# EAGLE design smr5 (EAGLE 7.2.0)
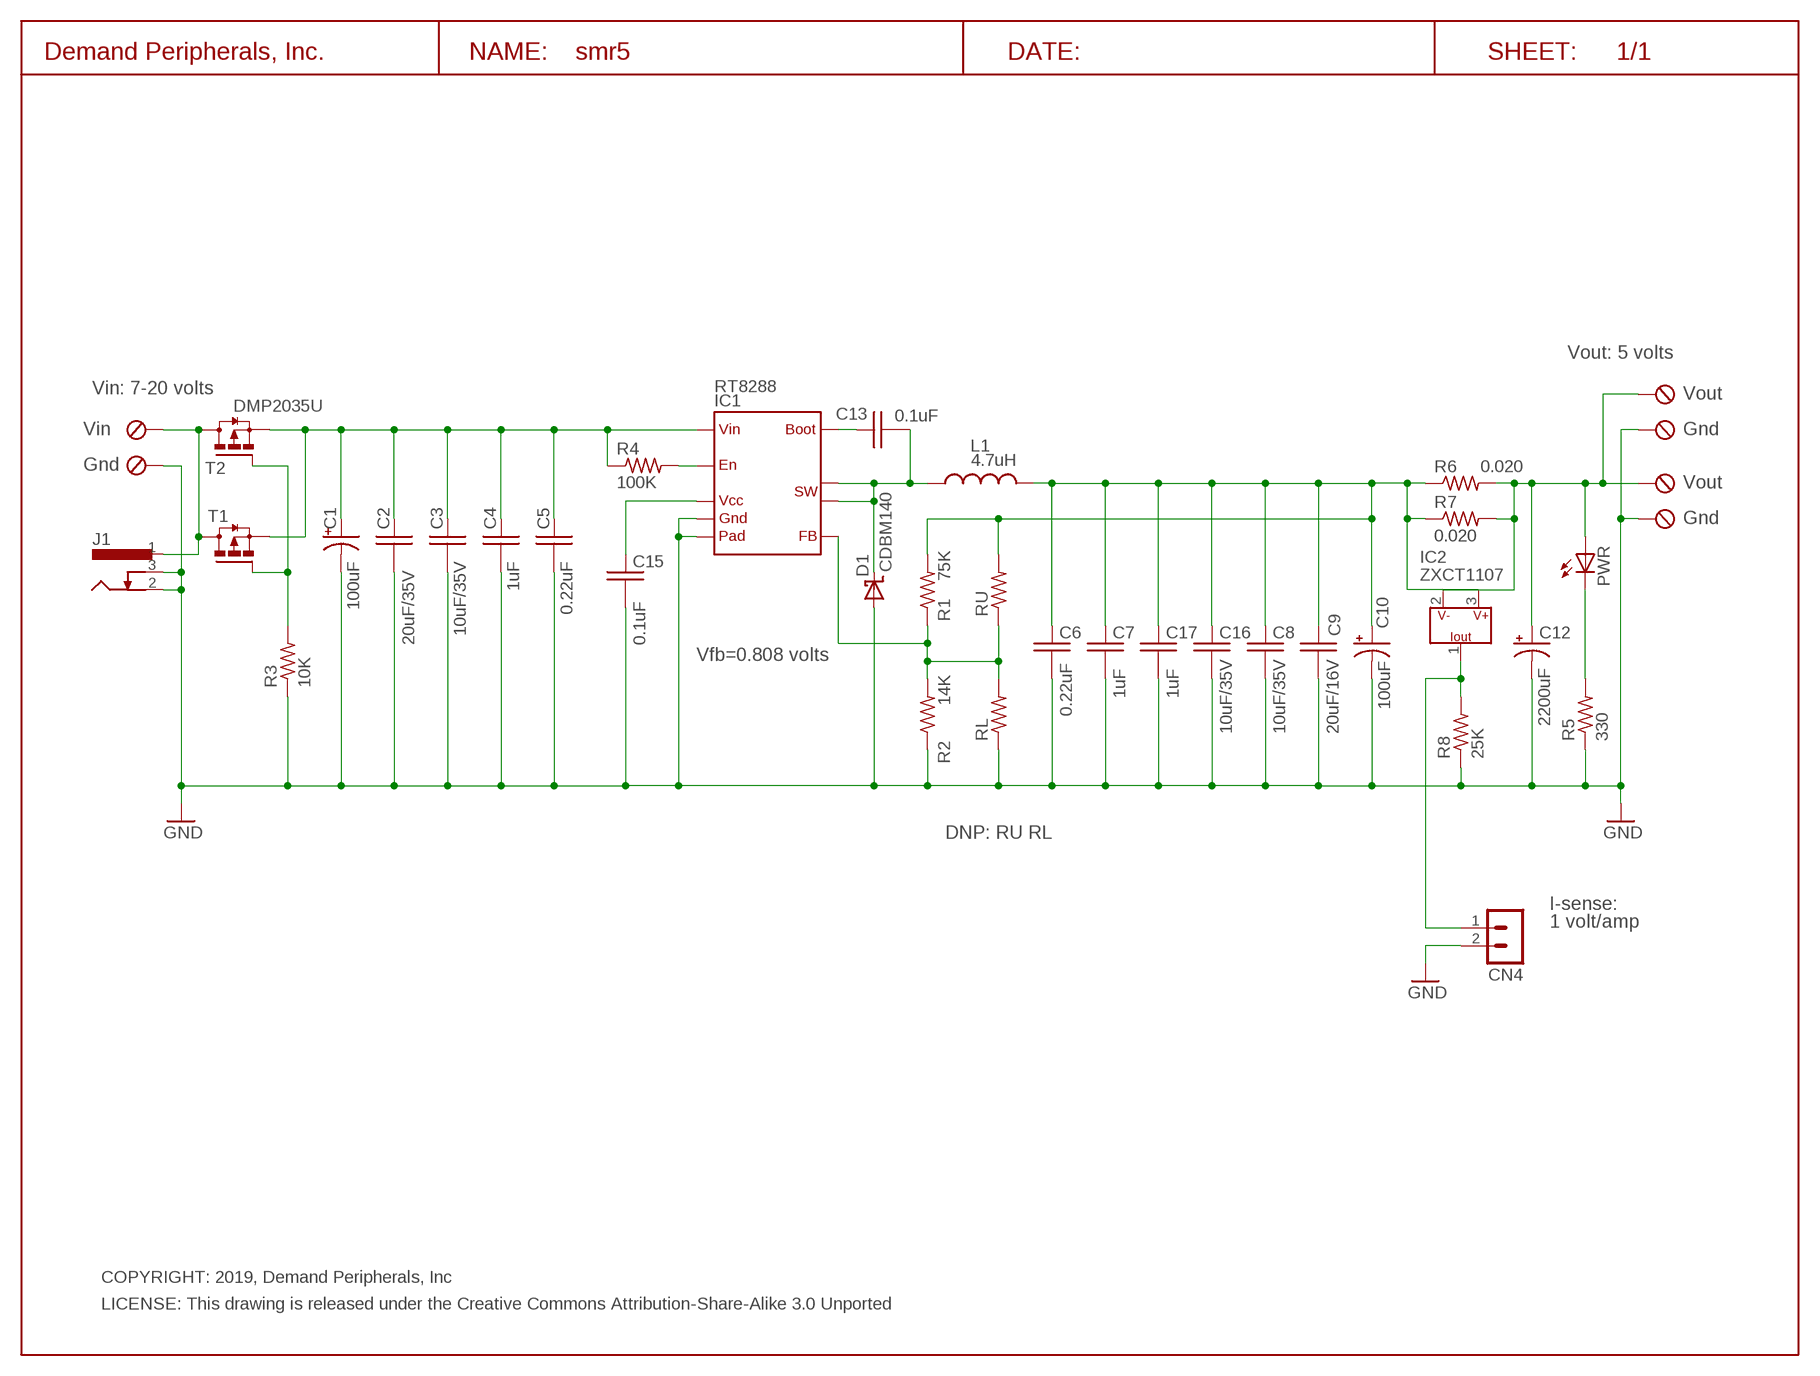
[diagram p0: schematic, sheet 1]

## Parts
C1  100uF  C100UF_E3.5-8  [E3.5-8]
C2  20uF/35V  C22UF35V_  [C1206]
C3  10uF/35V  C10UF35V_C0805  [C0805]
C4  1uF  C1.0UF_C0603  [C0603]
C5  0.22uF  C0.22UFC0805  [C0805]
C6  0.22uF  C0.22UFC0805  [C0805]
C7  1uF  C1.0UF_C0603  [C0603]
C8  10uF/35V  C10UF35V_C0805  [C0805]
C9  20uF/16V  C22UF16V_  [C1210]
C10  100uF  C100UF_E3.5-8  [E3.5-8]
C12  2200uF  C2200UF10V_E7,5-16  [E7,5-16]
C13  0.1uF  C0.1UF_C0603  [C0603]
C15  0.1uF  C0.1UF_C0603  [C0603]
C16  10uF/35V  C10UF35V_C0805  [C0805]
C17  1uF  C1.0UF_C0603  [C0603]
CN1  TBLK-5.08-X2  [TBLK-5.08-X2]
CN2  TBLK-5.08-X2  [TBLK-5.08-X2]
CN3  TBLK-5.08-X2  [TBLK-5.08-X2]
CN4  HDR-2X1-LCK  [HDR-2X1]
D1  CDBM140  [SOD123T]
IC1  RT8288  [SOIC8-PAD]
IC2  ZXCT1107  [ZXCT]
J1  DC-BARREL-JACK--55MM  [DC-BARREL-JACK-55MM]
L1  4.7uH  VLF10045-4.7  [TDKVLFIND]
PWR  LED-5MM-RED  [LED5MM]
R1  75K  R75K_R0603  [R0603]
R2  14K  R14K_R0603  [R0603]
R3  10K  R10K_R0603  [R0603]
R4  100K  R100K_R0603  [R0603]
R5  330  R330_R0603  [R0603]
R6  0.020  R0.02_R0805  [R0805]
R7  0.020  R0.02_R0805  [R0805]
R8  25K  R25K_R0603  [R0603]
RL  R0.02_R0805  [R0805]
RU  R0.02_R0805  [R0805]
T1  DMP2035U  DMP2035  [SOT23]
T2  DMP2035U  DMP2035  [SOT23]
U$1  DP_FRAME_L  [LETTER_L]

## Nets
GND: C1.- C2.2 C3.2 C4.2 C5.2 C6.2 C7.2 C8.2 C9.2 C10.- C12.- C15.2 C16.2 C17.2 CN1.1(KL) CN2.1(KL) CN3.1(KL) CN4.2 D1.A IC1.8(GND) IC1.9(GND-PAD) J1.2 J1.3 R2.1 R3.1 R5.1 R8.1 RL.1
N$1: R3.2 T1.1(G) T2.1(G)
N$2: C13.1 IC1.4(BOOT)
N$3: C13.2 D1.C(CC) IC1.2(SW0) IC1.3(SW1) L1.P$1
N$4: PWR.C R5.2
N$5: CN4.1 IC2.1(IOUT) R8.2
N$6: C12.+ CN2.2(KL1) CN3.2(KL1) IC2.2(V-) PWR.A R6.2 R7.2
N$17: IC1.5(EN) R4.2
N$19: C15.1 IC1.7(VCC)
N$21: IC1.6(FB) R1.1 R2.2 RL.2 RU.1
N$23: CN1.2(KL1) J1.1 T1.3(D) T2.3(D)
SW-OUT: C6.1 C7.1 C8.1 C9.1 C10.+ C16.1 C17.1 IC2.3(V+) L1.P$2 R1.2 R6.1 R7.1 RU.2
V+: C1.+ C2.1 C3.1 C4.1 C5.1 IC1.1(VIN) R4.1 T1.2(S) T2.2(S)

## Notes on the sheet
- Vout: 5 volts
- Vin: 7-20 volts | Vout
- Vin | Gnd
- Gnd
- Vout
- Gnd
- Vfb=0.808 volts
- DNP: RU RL
- I-sense:
- 1 volt/amp
- COPYRIGHT: 2019, Demand Peripherals, Inc
- LICENSE: This drawing is released under the Creative Commons Attribution-Share-Alike 3.0 Unported

## Library data of the parts
C1 C10 = dpi-passive:C100UF_: 100uF polarized capacitor, general purpose; VENDOR: Digikey; VENDOR-PART-NUM: 1572-1044-ND
C2 = dpi-passive:C22UF35V_: 22uF X5R ceramic capacitor, 35V, low ESR; VENDOR: Digikey; VENDOR-PART-NUM: 445-8045-1-ND
C3 C8 C16 = dpi-passive:C10UF35V_: 10 uF Capacitor, 35V, X6S; VENDOR: Digikey; VENDOR-PART-NUM: 490-10504-2-ND
C4 C7 C17 = dpi-passive:C1.0UF_: 1.0 uF Capacitor, 25V, Y5V; VENDOR: Digikey; VENDOR-PART-NUM: 490-3897-2-ND
C5 C6 = dpi-passive:C0.22UF: 0.22 uF Capacitor, 50V, X7R; VENDOR: Digikey; VENDOR-PART-NUM: 1276-6478-1-ND
C9 = dpi-passive:C22UF16V_: 22uF X7R ceramic capacitor, 16V, low ESR; VENDOR: Digikey; VENDOR-PART-NUM: 490-4740-1-ND
C12 = dpi-passive:C2200UF10V_: 2200uF polarized capacitor, 10 volts, general purpose; VENDOR: Digikey; VENDOR-PART-NUM: 493-1503-ND
C13 C15 = dpi-passive:C0.1UF_: 0.1 uF Capacitor, 25V, X7R; VENDOR: Digikey; VENDOR-PART-NUM: 1276-1126-2-ND
CN1-CN3 = dpi-conn:TBLK-5.08-X2: Terminal Block, 5.08mm, x2, screw terminals; VENDOR: Digikey; VENDOR-PART-NUM: ED2609-ND
CN4 = dpi-conn:HDR-2X1-LCK: 2x1 pin header with friction lock; VENDOR: Mouser; VENDOR-PART-NUM: 571-6404562
D1 = dpi-diopto:CDBM140: CDBM140 Schottky, 1A, 200V; VENDOR: Digikey; VENDOR-PART-NUM: 641-1325-1-ND
IC1 = dpi-transic:RT8288: 4 Amp synchronous switching regulator; VENDOR: Digikey; VENDOR-PART-NUM: 1028-1148-1-ND
IC2 = dpi-transic:ZXCT1107: ZXCT 1107 Current monitor
J1 = dpi-conn:DC-BARREL-JACK--55MM: 5.5 mm DC POWER JACK, CUI PJ-102AH; VENDOR: Digikey; VENDOR-PART-NUM: CP-102AH-ND
L1 = dpi-passive:VLF10045-4.7: 4.7 uH VLF10045; VENDOR: Digikey; VENDOR-PART-NUM: 445-3576-1-ND
PWR = dpi-diopto:LED-5MM-RED: Red LED, 5 MM, through-hole; VENDOR: Digikey; VENDOR-PART-NUM: 160-1853-ND
R1 = dpi-passive:R75K_: 75K Resistor, 1%, 0.1 watt; VENDOR: Digikey; VENDOR-PART-NUM: 311-75.0KHRTR-ND
R2 = dpi-passive:R14K_: 14K Resistor, 1%, 0.1 watt; VENDOR: Digikey; VENDOR-PART-NUM: 311-14.0KHRTR-ND
R3 = dpi-passive:R10K_: 10K Resistor, 1%, 0.1 watt; VENDOR: Digikey; VENDOR-PART-NUM: 311-1.00KHRTR-ND
R4 = dpi-passive:R100K_: 100K Resistor, 1%, 0.1 watt; VENDOR: Digikey; VENDOR-PART-NUM: 311-100KHRTR-ND
R5 = dpi-passive:R330_: 330 Ohm resistor, 1%, 0.1 watt; VENDOR: Digikey; VENDOR-PART-NUM: 311-330HRTR-ND
R6 R7 RL RU = dpi-passive:R0.02_: 0.02 Ohm resistor, 1%, 0.33 watt; VENDOR: Digikey; VENDOR-PART-NUM: 1276-6157-1-ND
R8 = dpi-passive:R25K_: 25K Resistor, 1%, 0.1 watt; VENDOR: Digikey; VENDOR-PART-NUM: 311-25.0KHRTR-ND
T1 T2 = dpi-transic:DMP2035: PFET; VENDOR: Digikey; VENDOR-PART-NUM: DMP2035U-7DICT-ND
U$1 = DP:DP_FRAME_L: Landscape/Letter Document Frame

## Board
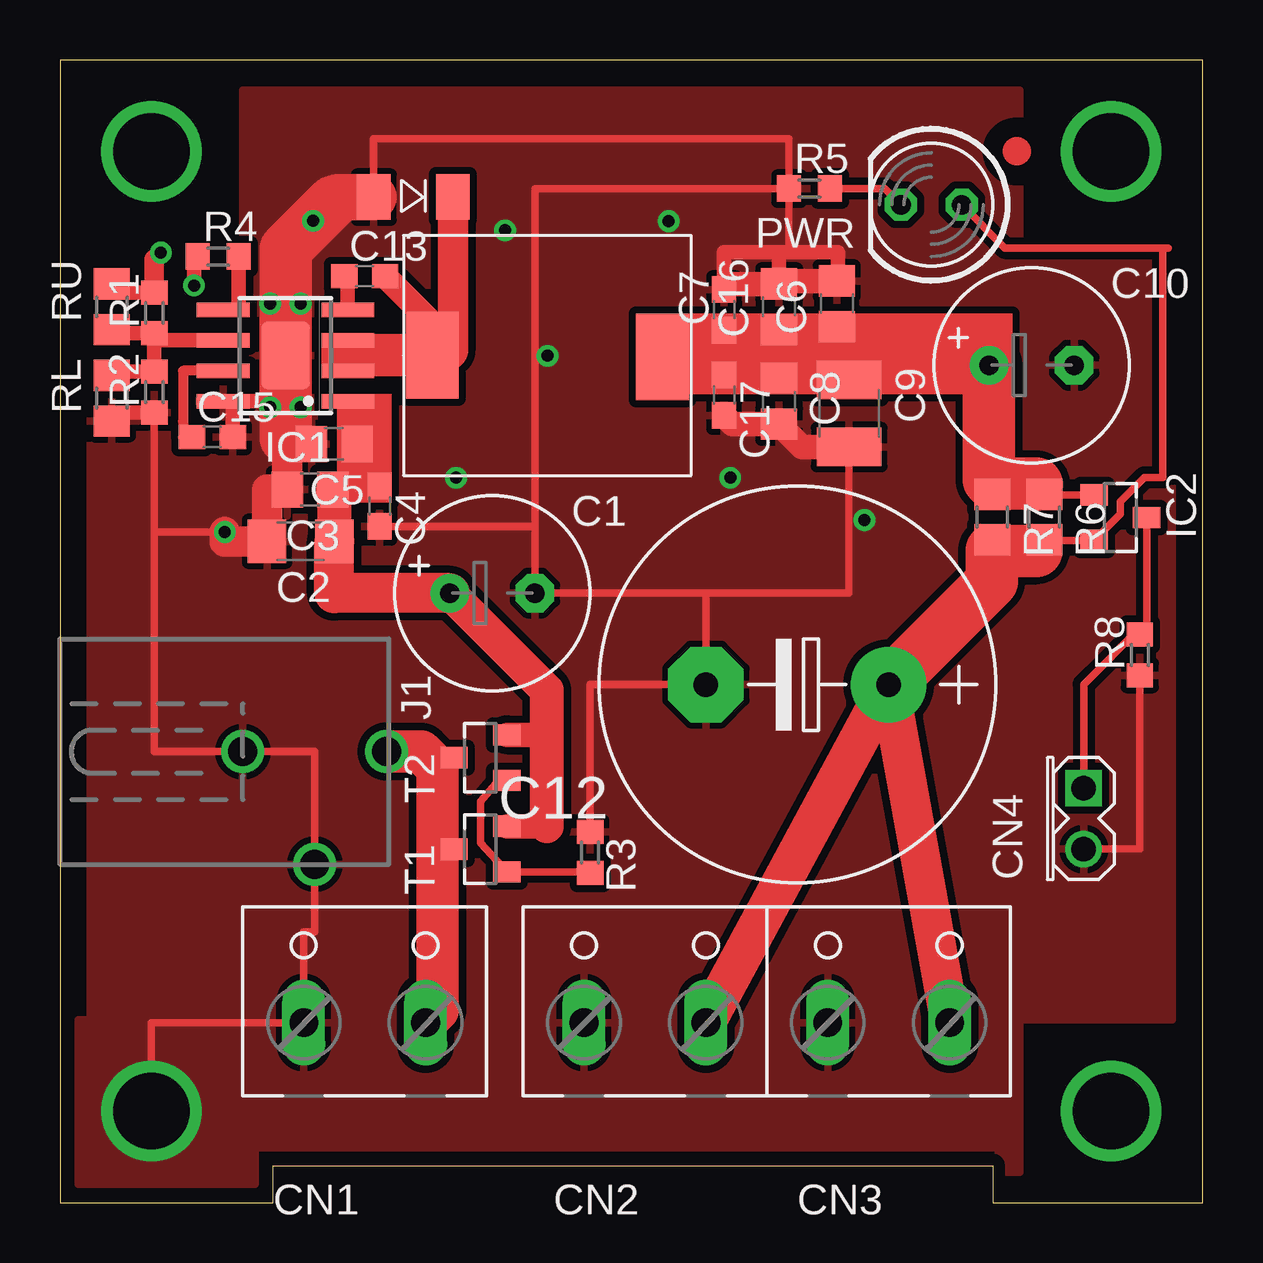
[diagram p1: board, top side]
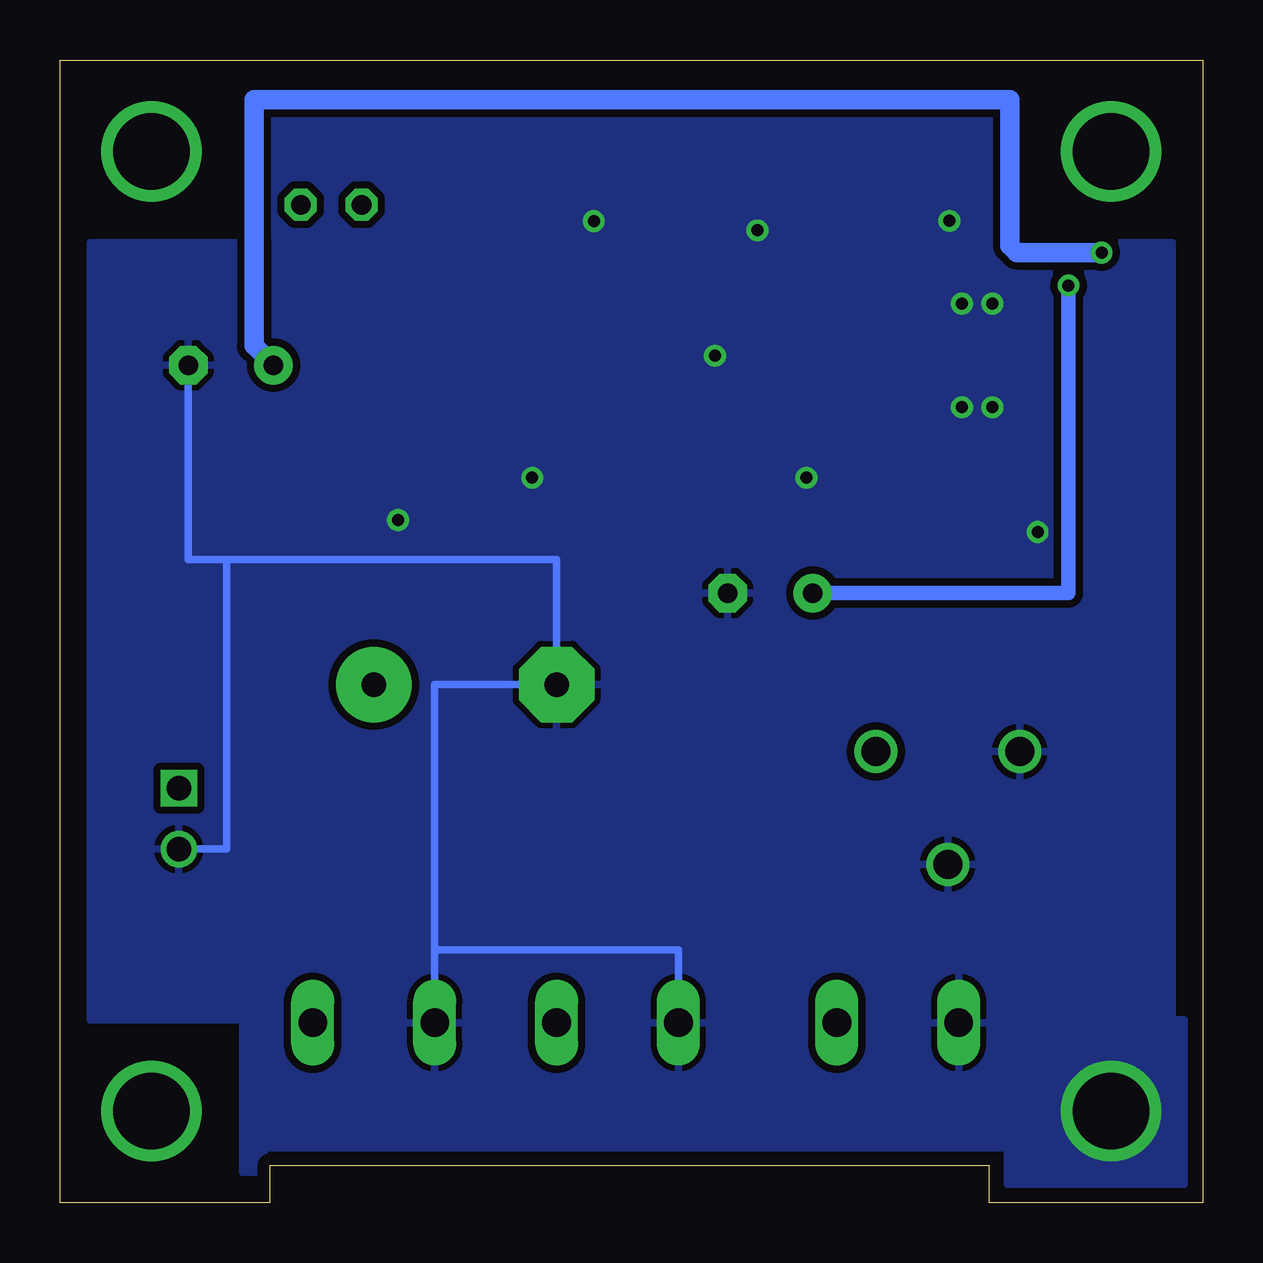
[diagram p2: board, bottom side, seen from below]

Size 47.62 x 47.62 mm. Coordinates in mm from the lower left corner, seen from the top.
Outline: 0,0 8.89,0 8.89,1.52 38.89,1.52 38.89,0 47.62,0 47.62,47.62 0,47.62 0,0
Copper layers (1*16): Top 0.035mm / dielectric 1.5mm / Bottom 0.035mm
Design rules "default *": minimum track width 10mil, minimum drill 15mil, track to track 12mil, track to pad 12mil, pad to pad 12mil, via to via 8mil, smd to smd 12mil, copper to edge 20mil, drill to drill 12mil, minimum pad ring 10mil, minimum via ring 8mil, stop-mask expansion 4mil, vias tented up to drill 40mil, thermal gap 10mil

### Footprints (pad centres in the part's own frame; a part is rotated, then mirrored left to right if it is on the bottom)
E3.5-8 = drill 0.813 pad 1.6: + -1.778,0 | drill 0.813 pad 1.6 octagon: - 1.778,0
C1206 = smd 1.6 x 1.8: 1 -1.4,0; 2 1.4,0
C0805 = smd 1.3 x 1.5: 1 -0.95,0; 2 0.95,0
C0603 = smd 1.1 x 1: 1 -0.85,0; 2 0.85,0
C1210 = smd 1.6 x 2.7: 1 -1.4,0; 2 1.4,0
E7,5-16 = drill 1.016 pad 3.15: + -3.81,0 | drill 1.016 pad 3.15 octagon: - 3.81,0
TBLK-5.08-X2 = drill 1.194 long: 1 -2.54,-0.127; 2 2.54,-0.127
HDR-2X1 = drill 1.016 square: 1 1.27,0 | drill 1.016: 2 -1.27,0
SOD123T = smd 1.4 x 1.9: A 1.65,0; C -1.65,0
SOIC8-PAD = smd 0.6 x 2.2: 1 -1.905,-2.6; 2 -0.635,-2.6; 3 0.635,-2.6; 4 1.905,-2.6; 5 1.905,2.6; 6 0.635,2.6; 7 -0.635,2.6; 8 -1.905,2.6 | smd 2.794 x 2.032: 9 0,0
ZXCT = smd 0.889 x 1.143: 1 0,-1.1; 2 -0.95,1.1; 3 0.95,1.1
DC-BARREL-JACK-55MM = drill 1.2: 1 0,5.994; 2 0,0; 3 4.699,2.997
TDKVLFIND = smd 2.2 x 3.6: P$1 -4.8,0; P$2 4.8,-0.05
LED5MM = drill 0.813 octagon: A -1.27,0; C 1.27,0
R0603 = smd 1 x 1.1: 1 -0.85,0; 2 0.85,0
R0805 = smd 1.3 x 1.5: 1 -0.95,0; 2 0.95,0
SOT23 = smd 0.889 x 1.143: 1 -0.95,-1.1; 2 0.95,-1.1; 3 0,1.1

### Placement (x,y rotation side)
C1  18.02,25.4 0 top
C2  10.03,27.56 180 top
C3  10.43,29.72 180 top
C4  13.32,29.03 270 top
C5  11.43,31.62 180 top
C6  32.38,37.47 90 top
C7  27.69,37.21 90 top
C8  29.97,33.4 270 top
C9  32.89,32.89 270 top
C10  40.5,34.9 0 top
C12  30.73,21.59 180 top
C13  12.7,38.61 0 top
C15  6.35,31.9 0 top
C16  29.97,37.34 90 top
C17  27.69,33.66 270 top
CN1  12.7,7.62 0 top
CN2  24.38,7.62 0 top
CN3  34.54,7.62 0 top
CN4  42.67,16 90 top
D1  14.73,41.91 180 top
IC1  9.4,35.31 90 top
IC2  44.2,28.55 90 top
J1  7.62,18.8 270 top
L1  20.32,35.31 0 top
PWR  36.32,41.59 180 top
R1  3.94,37.08 90 top
R2  3.94,33.78 90 top
R3  22.1,14.59 270 top
R4  6.59,39.43 0 top
R5  31.24,42.27 0 top
R6  41.02,28.57 270 top
R7  38.86,28.57 270 top
R8  45.01,22.82 90 top
RL  2.16,33.53 90 top
RU  2.16,37.34 90 top
T1  17.53,14.73 90 top
T2  17.53,18.54 90 top
U$1  -2.54,-2.54 0 top
U$2  [DPI-2]  21.84,42.67 0 bottom
U$3  [FIDUCIAL]  39.88,43.81 0 top

### Tracks (layer width: path | path; a pad name or v marks a point on that pad's centre or on a via)
GND  (via drill 0.5, 3.17)
  Top 0.254: v8.76,33.15 v10.03,33.15 10.03,35.31 IC1.9 8.76,35.31 v8.76,37.47 v10.03,37.47 9.4,38.1 9.4,38.32
  Top 0.305: v3.81,3.81 3.81,7.49 CN1.1 10.16,11.28 10.38,11.28 10.62,11.28 J1.3 10.62,18.8 J1.2 3.94,18.8 3.94,28.14 | R2.1 3.94,28.14 | 3.94,28.14 3.94,27.95 v6.87,27.95 | R5.1 30.39,44.34 13.66,44.34 13.08,44.34 D1.A | R5.1 19.8,42.27 19.8,28 | 19.8,28 C1.- 26.92,25.4 | C4.2 19.8,28.18 19.8,28 | C5.2 9.48,31.62 9.48,31.8 | R5.1 30.39,39.62 | 26.92,25.4 C12.- 22.1,21.59 R3.1 | C9.2 32.89,25.4 26.92,25.4 | R8.1 45.01,14.73 CN4.2
  Top 0.61: IC1.8 7.35,33.4 | 8.76,33.4 v8.76,33.15 arc90 8.51,33.4 7.35,33.4 | C15.2 7.2,33.25 7.35,33.4 | RL.1 2.16,32.93 R2.1 | 30.1,38.41 32.42,38.41 32.42,39.62 | 32.41,39.62 30.39,39.62 30.1,39.62 | 30.1,39.62 29.97,39.62 C16.2 | C7.2 27.69,39.62 30.1,39.62
  Top 1.016: C17.2 28.04,32.45 C8.2 30.93,31.49 C9.2 | C7.2 27.91,38.29 C16.2 30.1,38.41 C6.2
  Top 1.27: 9.4,31.88 arc-90 9.48,31.8 C3.2 8.63,29.72 C2.2 6.87,27.56 v6.87,27.95
  Top 1.93: 11.38,41.72 11.57,41.91 D1.A
  Top 2.184: 9.4,31.88 9.4,38.32 9.4,39.74 11.38,41.72
  Bottom 0.305: C10.- 42.28,26.81 40.68,26.81 | 40.68,26.81 32.05,26.81 26.92,26.81 C12.- 32,21.59 32,10.54 | CN4.2 40.68,14.73 40.68,26.81 | 32,10.54 CN3.1 | CN2.1 21.84,10.54 32,10.54
  other vias: 18.55,40.53 25.37,40.91 20.32,35.29 33.53,28.45 27.94,30.21 16.51,30.21 10.55,40.92
  pour Bottom: 0.76,0.76 0.76,7.62 1.27,7.62 1.27,40.01 7.62,40.01 7.62,46.35 40.01,46.35 40.01,40.01 46.35,40.01 46.35,7.62 40.01,7.62 40.01,1.27 39.12,1.27 39.12,2.29 8.14,2.29 8.13,0.76
  pour Top: 0.76,0.76 0.76,7.62 1.27,7.62 1.27,40.01 7.62,40.01 7.62,46.35 40.01,46.35 40.01,40.01 46.35,40.01 46.35,7.62 40.01,7.62 40.01,1.27 39.12,1.27 39.12,2.29 8.13,2.29 8.14,0.76
N$1
  Top 0.305: R3.2 22.06,13.78 T1.1 17.54,14.98 17.54,16.73 18.29,17.59 T2.1
N$2
  Top 0.61: IC1.4 12,38.46 arc90 C13.1
N$3
  Top 0.254: IC1.2 12,35.05 arc-90 12.25,35.31 | 12.25,35.31 L1.P$1 12.25,35.31 | IC1.3 12,35.56 arc90 12.25,35.31
  Top 1.016: C13.2 15.45,36.71 arc-45 15.52,36.53 L1.P$1
  Top 1.27: D1.C 16.38,35.56 arc-90 16.13,35.31 L1.P$1
N$4
  Top 0.305: PWR.C 34.38,42.27 R5.2
N$5
  Top 0.305: 45.18,23.85 R8.2 | R8.2 44.74,23.67 43,21.93 42.67,21.6 CN4.1 | IC2.1 45.3,23.96 R8.2
N$6
  Top 0.305: PWR.A 39.4,39.79 46.2,39.79 45.97,39.79 45.97,30.23 45.2,30.23 44.2,29.22 44.2,28.7 IC2.2 41.05,27.6 R6.2 | 40.69,27.16 41.02,27.5 R6.2 | R6.2 R7.2
  Top 1.676: CN3.2 C12.+ CN2.2
  Top 2.184: C12.+ 38.84,25.88 38.84,27.19 38.86,27.16 40.69,27.16
N$17
  Top 0.61: R4.2 7.44,37.21 IC1.5
N$19
  Top 0.406: IC1.7 5.13,34.67 5.13,32.56 5.13,31.9 C15.1
N$21
  Top 0.61: RU.1 2.31,36.23 R1.1 4.23,35.94 IC1.6 3.94,35.94 R2.2 2.31,34.63 RL.2
N$23
  Top 0.305: T2.3 16.43,18.1 15.75,18.1 | T1.3 16.43,18.2 15.65,18.2
  Top 1.778: CN1.2 15.75,8 15.75,18.1 15.65,18.2 15.05,18.8 J1.1
S$2  (via drill 3.17 pad 3.17)
  other vias: 3.81,43.81
S$3  (via drill 3.17 pad 3.17)
  other vias: 43.81,43.81
S$4  (via drill 3.17 pad 3.17)
  other vias: 43.81,3.81
SW-OUT  (via drill 0.5)
  Top 0.254: L1.P$2 arc90 25.87,34.51 C17.1 | C17.1 C7.1 arc-90 27.84,36.52 C16.1 C6.1 | C17.1 29.82,34.51 arc-90 C8.1 32.84,34.35 arc-90 C9.1 arc-90 33.5,34.9 C10.+
  Top 0.305: IC2.3 41.12,29.5 | 41.12,29.5 41.05,29.5 R6.1 | 41.12,29.5 38.89,29.5 R7.1 38.86,29.95 38.88,29.96
  Top 0.61: RU.2 2.16,37.93 R1.2
  Top 0.813: v4.2,39.6 3.94,39.33 R1.2
  Top 2.184: C10.+ 38.72,30.11 38.88,29.96 40.69,29.96 40.72,29.93
  Bottom 0.813: C10.+ 39.53,35.71 39.53,40.17 39.53,45.97 38.35,45.97 10.16,45.97 8.64,45.97 8.03,45.97 8.03,39.88 7.75,39.6 v4.2,39.6
V+  (via drill 0.5)
  Top 0.254: C3.1 11.54,29.88 12.27,29.88 | 12.27,29.88 C4.1 | IC1.1 12.38,33.02 C5.1 12.27,31.51 12.27,29.88
  Top 0.61: R4.1 5.59,39.28 v5.59,38.23
  Top 1.016: T2.2 20.16,19.49 arc90 20.28,19.61 | T1.2 20.28,15.68 20.28,15.7
  Top 1.422: C1.+ 20.28,21.36 20.28,19.61 20.28,15.7 | C3.1 11.43,29.66 C2.1
  Top 1.676: C1.+ 11.43,25.4 C2.1
  Bottom 0.61: v5.59,38.23 5.59,25.4 C1.+
(copper drawn outside any net)
  shapes: Top area x3

### Text on the board
tTest: 1.875 Inches | 1.575 Inches | (C) 2019, Demand Peripherals, Inc. | SMR5, Rev 19C | PWR | D1 | R5 | R4 | RL | C13 | C6 | C16 | C7 | IC1 | C9 | R2 | C5 | R1 | C15 | C8 | C10 | RU | C4 | C17 | IC2 | C3 | L1 | R6 | C2 | R7 | J1 | R8 | C1 | T1 | 1.575 Inches | 1.875 Inches | Volts | T2 | R3 | C12 | 7-20 | Vin | 1 volt / /amp | Vin | 5V | 5V